# Altium schematic sheet StaticModulo_v1i2.SchDoc
size A
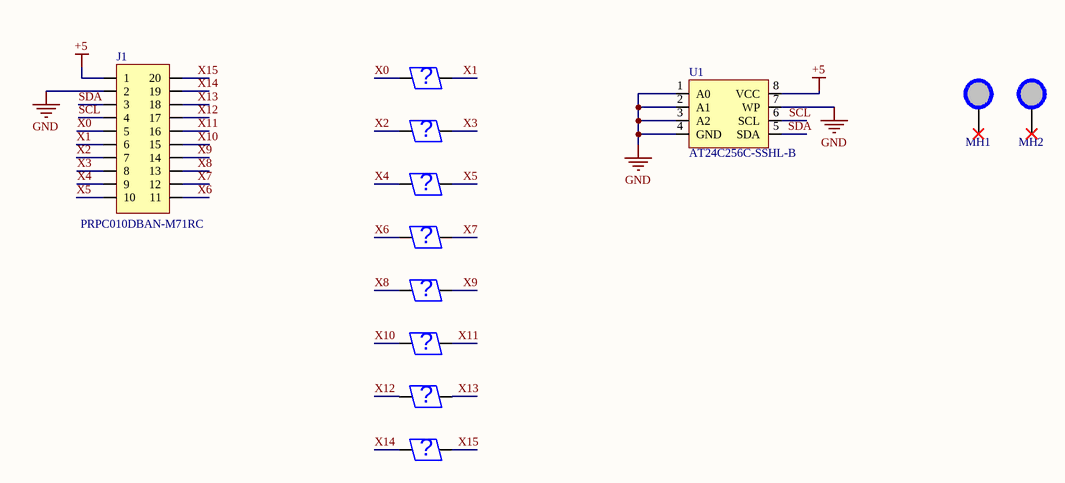
[diagram p0: StaticModulo_v1i2.SchDoc]

## Parts
J1  PRPC010DBAN-M71RC  [HDR_MALE_10x2x2.54]
MH1  MH 3.2mm NP  [MH3.2mm]  (value not drawn)  (no BOM)
MH2  MH 3.2mm NP  [MH3.2mm]  (value not drawn)  (no BOM)
U1  AT24C256C-SSHL-B  [AT24C256C-SSHL-B]
U2  VirtualComponentStatic  [Virtual_Component_Static]  (value not drawn)  (no BOM)
U3  VirtualComponentStatic  [Virtual_Component_Static]  (value not drawn)  (no BOM)
U4  VirtualComponentStatic  [Virtual_Component_Static]  (value not drawn)  (no BOM)
U5  VirtualComponentStatic  [Virtual_Component_Static]  (value not drawn)  (no BOM)
U6  VirtualComponentStatic  [Virtual_Component_Static]  (value not drawn)  (no BOM)
U7  VirtualComponentStatic  [Virtual_Component_Static]  (value not drawn)  (no BOM)
U8  VirtualComponentStatic  [Virtual_Component_Static]  (value not drawn)  (no BOM)
U9  VirtualComponentStatic  [Virtual_Component_Static]  (value not drawn)  (no BOM)

## Nets
+5: J1.1 U1.8(VCC)
GND: J1.2 U1.1(A0) U1.2(A1) U1.3(A2) U1.4(GND) U1.7(WP)
SCL: J1.4 U1.6(SCL)
SDA: J1.3 U1.5(SDA)
X0: J1.5 U2.1
X1: J1.6 U2.2
X2: J1.7 U3.1
X3: J1.8 U3.2
X4: J1.9 U4.1
X5: J1.10 U4.2
X6: J1.11 U5.1
X7: J1.12 U5.2
X8: J1.13 U6.1
X9: J1.14 U6.2
X10: J1.15 U7.1
X11: J1.16 U7.2
X12: J1.17 U8.1
X13: J1.18 U8.2
X14: J1.19 U9.1
X15: J1.20 U9.2

Not connected (* = marked no-connect by the designer): MH1 1*; MH2 1*

## Notes on the sheet
- (in symbol VirtualComponentStatic) ?

## Library data of the parts
J1 = HDR Male 2x10_2.54: 20 Positions Header, Unshrouded, Breakaway Connector 0.100" (2.54mm) Through Hole, Right Angle Gold; Manufacturer: Sullins; Number of Positions: 20; Connector Type: Male Pin; Pitch: 0.1inch; Supplier 1: Digi-Key; Manufacturer Part Number: PRPC010DBAN-M71RC; Stock 1: 459; Mount: Through Hole; Colour: Black; Contact Plating: Gold; Package Quantity: 1; Number of Rows: 2; Packaging: Bulk; Termination: Solder; Row Spacing: 0.1inch; Contact Mating Length: 0.23inch; ComponentLink1URL: https://datasheet.ciiva.com/741/xrxczzzdxxn-m71rc-11639-b-741675.pdf; ComponentLink1Description: https://datasheet.ciiva.com/741/xrxczzzdxxn-m71rc-11639-b-741675.pdf; Supplier Part Number 1: S2111EC-10-ND; Pricing 1: 1=1.08, 10=0.97, 100=0.7989, 500=0.6315, 1000=0.5421, 5000=0.49455, 10000=0.47553 (USD); System: Connector
MH1 MH2 = MHNP: Mounting hole 3.2mm non plated
U1 = AT24C256C-SSHL-B: ATMEL         AT24C256C-SSHL-B            EEPROM, 256 Kbit, 32K x 8bit, 1 MHz, Serial, SOIC, 8 Pins; Manufacturer: Microchip / Atmel; Interface: I2C,Serial,2-Wire; Min Supply Voltage: 1.7V; Max Supply Voltage: 5.5V; Access Time: 550ns; Number of Words: 32768; Density: 256Kb; Frequency: 1MHz; Nominal Supply Current: 3mA; Voltage: 5V; Supplier 1: Digi-Key; Manufacturer Part Number: AT24C256C-SSHL-B; Stock 1: 4655; Mount: Surface Mount; Case/Package: SOIC; Number of Pins: 8; Contact Plating: Tin,Matte; Min Operating Temperature: -40°C; Max Operating Temperature: 85°C; Packaging: Bulk; Package Quantity: 100; Memory Type: EEPROM; Memory Size: 256Kb; Max Frequency: 1MHz; Length: 5.05mm; Height: 1.5mm; Width: 3.99mm; Radiation Hardening: No; REACH SVHC: No SVHC; ComponentLink1URL: https://datasheet.ciiva.com/15123/getdatasheetpartid-367456-15123424.pdf; ComponentLink1Description: https://datasheet.ciiva.com/15123/getdatasheetpartid-367456-15123424.pdf; ComponentLink2URL: https://datasheet.ciiva.com/15123/getdatasheetpartid-304516-15123348.pdf; ComponentLink2Description: https://datasheet.ciiva.com/15123/getdatasheetpartid-304516-15123348.pdf; ComponentLink3URL: https://datasheet.ciiva.com/1910/atmel-8568-seeprom-at24c256c-datasheet-1910422.pdf; ComponentLink3Description: https://datasheet.ciiva.com/1910/atmel-8568-seeprom-at24c256c-datasheet-1910422.pdf; ComponentLink4URL: https://datasheet.ciiva.com/1509/1726561-1509879.pdf; ComponentLink4Description: https://datasheet.ciiva.com/1509/1726561-1509879.pdf; Supplier Part Number 1: AT24C256C-SSHL-B-ND; Pricing 1: 1=0.68, 10=0.619, 25=0.6108, 100=0.543 (USD)